# Altium project IF.PrjPcb
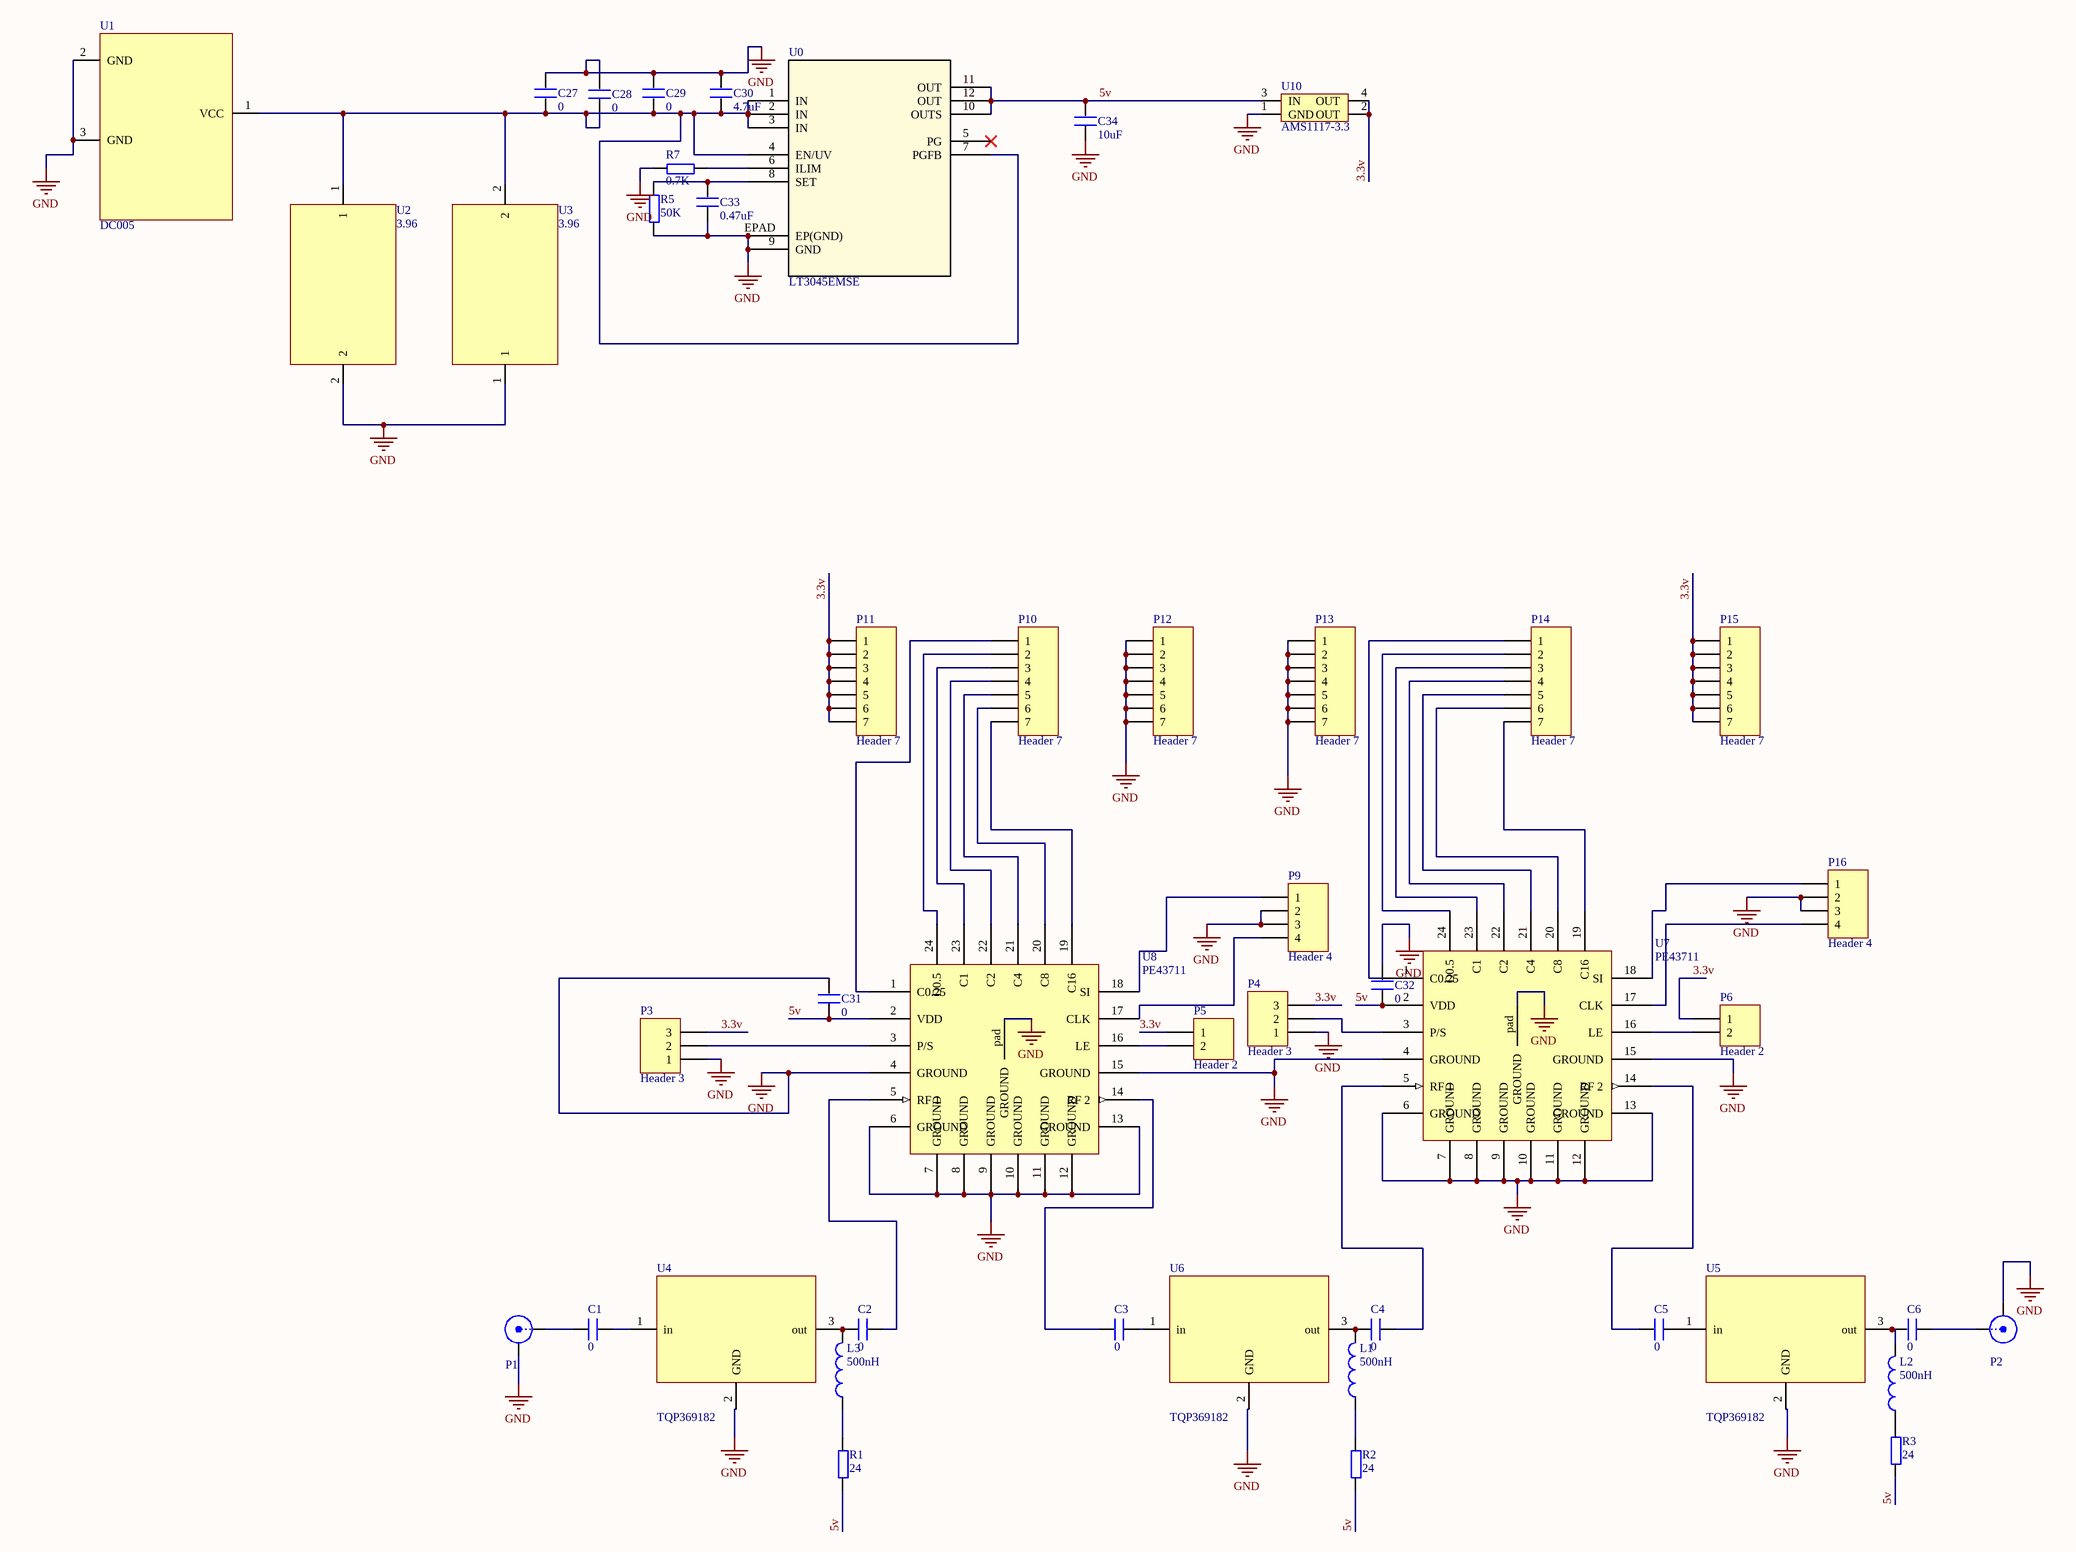
[diagram p0: IF.SchDoc]
1 sheet, 46 parts. Net scope: global (net labels, ports and power ports of the same name join across sheets).
Board file: IF.PcbDoc

## Sheet IF.SchDoc
size A1

### Parts
C1  0  [0402]
C2  0  [0402]
C3  0  [0402]
C4  0  [0402]
C5  0  [0402]
C6  0  [0402]
C27  0  [CAP 1.5*4*8]
C28  0  [CAP 1.5*4*8]
C29  0  [0603C]
C30  4.7uF  [0603C]
C31  0  [0402]
C32  0  [0402]
C33  0.47uF  [0402]
C34  10uF  [0402]
L1  500nH  [0402]
L2  500nH  [0402]
L3  500nH  [0402]
P1  SMA  [SMA]  (value not drawn)
P2  SMA  [SMA]  (value not drawn)
P3  Header 3  [HDR1X3]
P4  Header 3  [HDR1X3]
P5  Header 2  [HDR1X2]
P6  Header 2  [HDR1X2]
P9  Header 4  [HDR1X4]
P10  Header 7  [HDR1X7]
P11  Header 7  [HDR1X7]
P12  Header 7  [HDR1X7]
P13  Header 7  [HDR1X7]
P14  Header 7  [HDR1X7]
P15  Header 7  [HDR1X7]
P16  Header 4  [HDR1X4]
R1  24  [0805]
R2  24  [0805]
R3  24  [0805]
R5  50K  [0402]
R7  0.7K  [0402]
U0  LT3045EMSE  [MSOP12-MSE-RevG_ADI]
U1  DC005  [DC10B]
U2  3.96  [3.96]
U3  3.96  [3.96]
U4  TQP369182  [SOT89_M]
U5  TQP369182  [SOT89_M]
U6  TQP369182  [SOT89_M]
U7  PE43711  [PE43711]
U8  PE43711  [PE43711]
U10  AMS1117-3.3  [AMS1117]

### Nets
GND: C27.2 C28.2 C29.2 C30.2 C31.2 C32.2 C33.1 C34.1 P1.2(Y) P2.2(Y) P3.1 P4.1 P9.2 P9.3 P12.1 P12.2 P12.3 P12.4 P12.5 P12.6 P12.7 P13.1 P13.2 P13.3 P13.4 P13.5 P13.6 P13.7 P16.2 P16.3 R5.1 R7.1 U0.9(GND) U0.EPAD(EP(GND)) U1.2(GND) U1.3(GND) U2.2 U3.1 U4.2(GND) U5.2(GND) U6.2(GND) U7.4(GROUND) U7.6(GROUND) U7.7(GROUND) U7.8(GROUND) U7.9(GROUND) U7.10(GROUND) U7.11(GROUND) U7.12(GROUND) U7.13(GROUND) U7.15(GROUND) U7.pad(GROUND) U8.4(GROUND) U8.6(GROUND) U8.7(GROUND) U8.8(GROUND) U8.9(GROUND) U8.10(GROUND) U8.11(GROUND) U8.12(GROUND) U8.13(GROUND) U8.15(GROUND) U8.pad(GROUND) U10.1(GND)
3.3v: P3.3 P4.3 P5.1 P6.1 P11.1 P11.2 P11.3 P11.4 P11.5 P11.6 P11.7 P15.1 P15.2 P15.3 P15.4 P15.5 P15.6 P15.7 U10.2(OUT) U10.4(OUT)
5v: C31.1 C32.1 C34.2 R1.1 R2.1 R3.1 U0.10(OUTS) U0.11(OUT) U0.12(OUT) U7.2(VDD) U8.2(VDD) U10.3(IN)
NetC1_1: C1.1 P1.1(X)
NetC1_2: C1.2 U4.1(in)
NetC2_1: C2.1 L3.2 U4.3(out)
NetC2_2: C2.2 U8.5(RF_1)
NetC3_1: C3.1 U8.14(RF_2)
NetC3_2: C3.2 U6.1(in)
NetC4_1: C4.1 L1.2 U6.3(out)
NetC4_2: C4.2 U7.5(RF_1)
NetC5_1: C5.1 U7.14(RF_2)
NetC5_2: C5.2 U5.1(in)
NetC6_1: C6.1 L2.2 U5.3(out)
NetC6_2: C6.2 P2.1(X)
NetC27_1: C27.1 C28.1 C29.1 C30.1 U0.1(IN) U0.2(IN) U0.3(IN) U0.4(EN/UV) U0.7(PGFB) U1.1(VCC) U2.1 U3.2
NetC33_2: C33.2 R5.2 U0.8(SET)
NetL1_1: L1.1 R2.2
NetL2_1: L2.1 R3.2
NetL3_1: L3.1 R1.2
NetP3_2: P3.2 U8.3(P/S)
NetP4_2: P4.2 U7.3(P/S)
NetP5_2: P5.2 U8.16(LE)
NetP6_2: P6.2 U7.16(LE)
NetP9_1: P9.1 U8.18(SI)
NetP9_4: P9.4 U8.17(CLK)
NetP10_1: P10.1 U8.1(C0.25)
NetP10_2: P10.2 U8.24(D0.5)
NetP10_3: P10.3 U8.23(C1)
NetP10_4: P10.4 U8.22(C2)
NetP10_5: P10.5 U8.21(C4)
NetP10_6: P10.6 U8.20(C8)
NetP10_7: P10.7 U8.19(C16)
NetP14_1: P14.1 U7.1(C0.25)
NetP14_2: P14.2 U7.24(D0.5)
NetP14_3: P14.3 U7.23(C1)
NetP14_4: P14.4 U7.22(C2)
NetP14_5: P14.5 U7.21(C4)
NetP14_6: P14.6 U7.20(C8)
NetP14_7: P14.7 U7.19(C16)
NetP16_1: P16.1 U7.18(SI)
NetP16_4: P16.4 U7.17(CLK)
NetR7_2: R7.2 U0.6(ILIM)

Not connected (* = marked no-connect by the designer): U0 5(PG)*

### Library data of the parts
C1-C6 C27-C34 = C: Capacitor
L1-L3 = Inductor: Value: 100uH; Published: 8-Jun-2000; Revision: July-2002: Re-released for DXP Platform.; Publisher: Altium Limited
P1 P2 = SMA: SMA Connector
P3 P4 = Header 3: Header, 3-Pin; LatestRevisionDate: 17-Jul-2002; LatestRevisionNote: Re-released for DXP Platform.; Publisher: Altium Limited
P5 P6 = Header 2: Header, 2-Pin; LatestRevisionDate: 17-Jul-2002; LatestRevisionNote: Re-released for DXP Platform.; Publisher: Altium Limited
P9 P16 = Header 4: Header, 4-Pin; LatestRevisionDate: 17-Jul-2002; LatestRevisionNote: Re-released for DXP Platform.; Publisher: Altium Limited
P10-P15 = Header 7: Header, 7-Pin; LatestRevisionDate: 17-Jul-2002; LatestRevisionNote: Re-released for DXP Platform.; Publisher: Altium Limited
R1-R3 R5 R7 = Resistor
U0 = LT3045EMSE: No Description Available; SourceLibrary: Analog_Devices_Inc_2020-09-15; Built_By: SunStream; Vendor: Analog Devices Inc; Copyright: Copyright (C) 2018 Accelerated Designs. All rights reserved; Manufacturer_Part_Number: LT3045EMSE; RefDes: RefDes; Type: DEV
U10 = AMS1117